# EAGLE design RoboRoach (EAGLE 6.4)
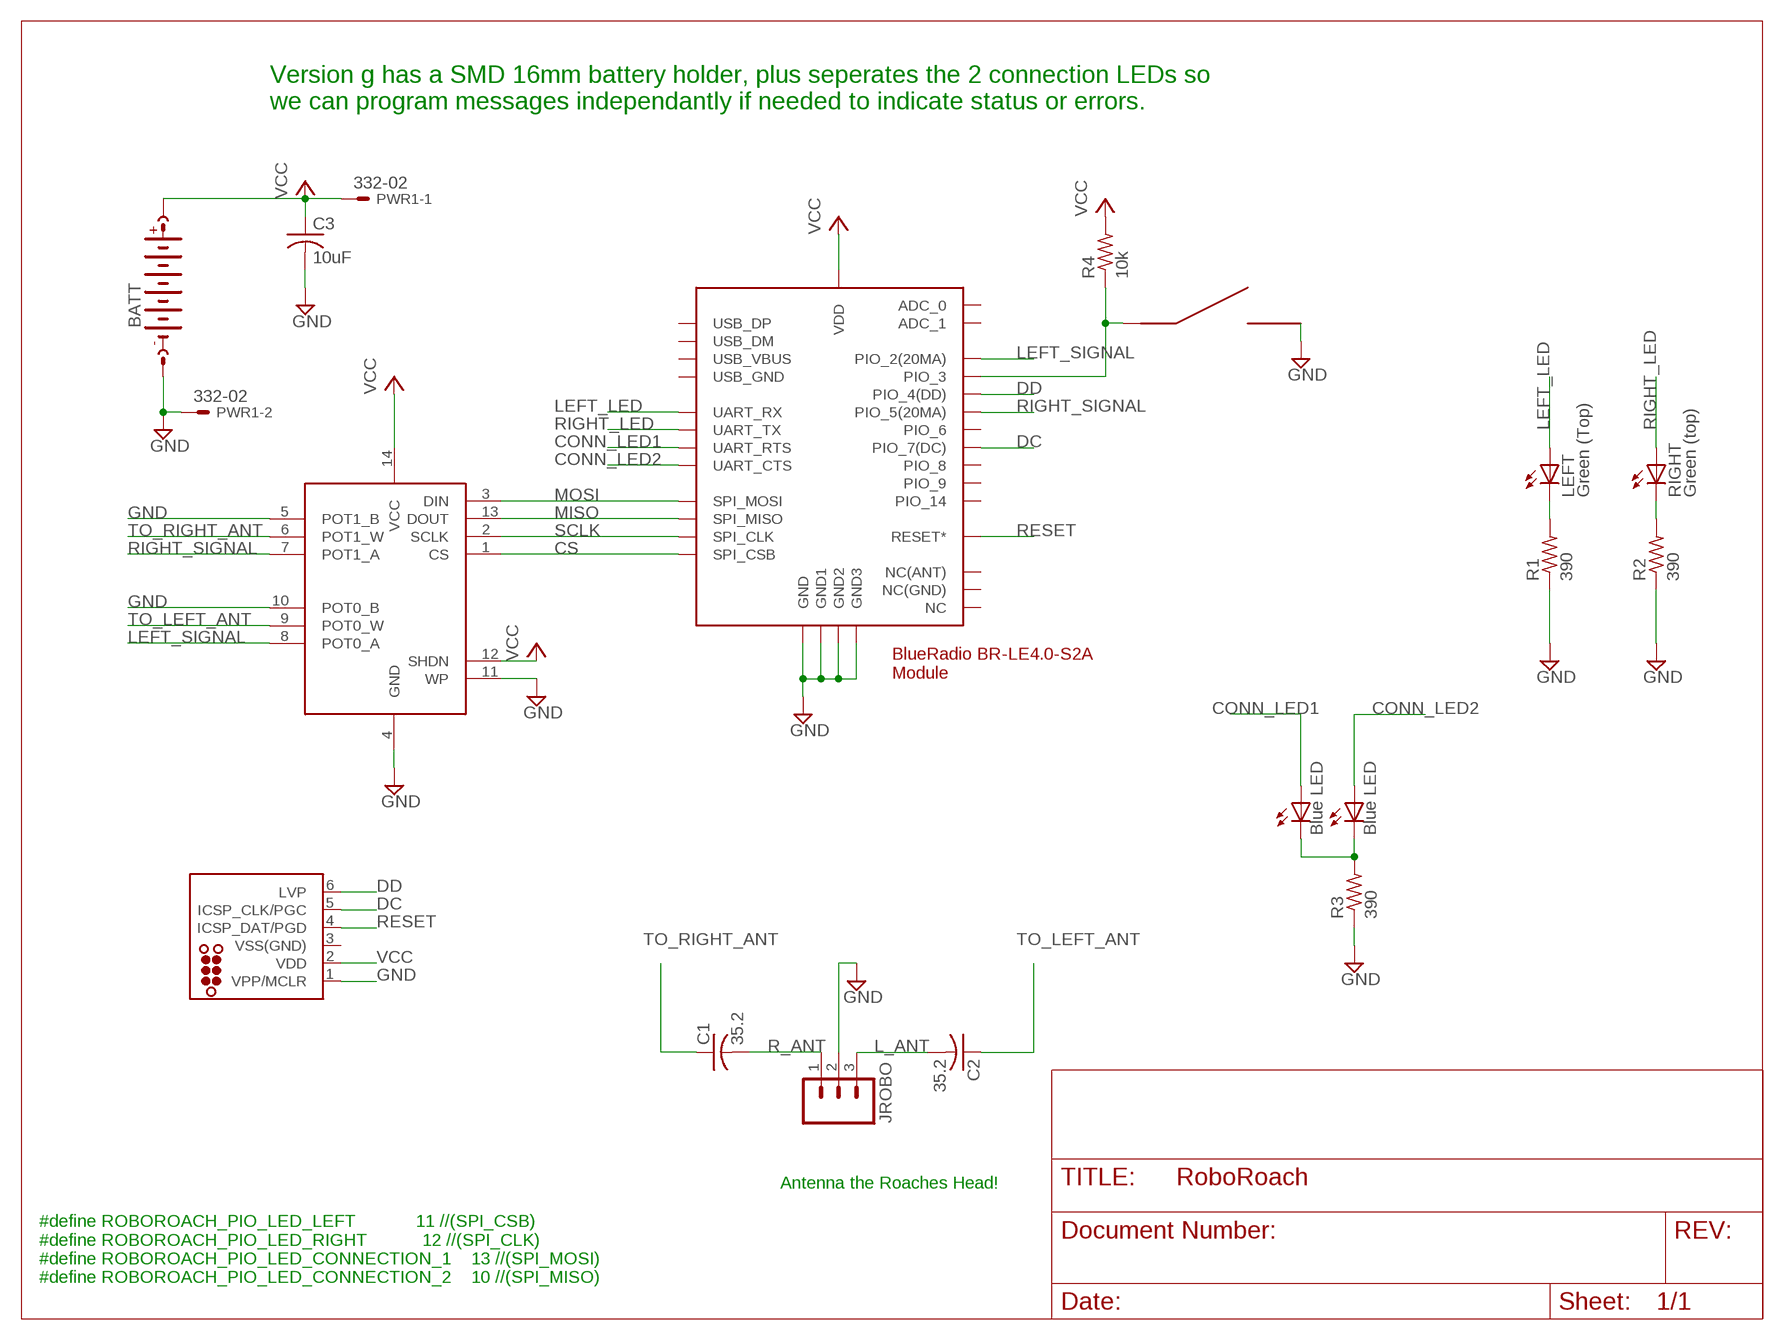
[diagram p0: schematic, sheet 1]

## Parts
BATT  BATTERY-16MMSMD  [16M_BATT_SMD]
C1  35.2  C-USC0805  [C0805]
C2  35.2  C-USC0805  [C0805]
C3  10uF  C-USC0805  [C0805]
CONNECTION  Blue LED  LEDCHIPLED_1206  [CHIPLED_1206]
CONNECTION1  Blue LED  LEDCHIPLED_1206  [CHIPLED_1206]
IC1  BR-LE4.0-S2  [BR-LE4.0-X2A]
J1  TC2030-MCP-NL  [TC2030-MCP-NL]
JROBO  M03PTH  [1X03]
LEFT  Green (Top)  LEDCHIPLED_1206  [CHIPLED_1206]
POT  MCP4251  [TSSOP14]
PWR1  332-02  [332-02]
R1  390  R-US_R0805  [R0805]
R2  390  R-US_R0805  [R0805]
R3  390  R-US_R0805  [R0805]
R4  10k  R-US_R0805  [R0805]
RIGHT  Green (top)  LEDCHIPLED_1206  [CHIPLED_1206]
U$2  B3U-1000X  [B3U]

## Nets
CONN_LED1: CONNECTION1.A IC1.P$12(UART_RTS)
CONN_LED2: CONNECTION.A IC1.P$11(UART_CTS)
CS: IC1.P$6(SPI_CSB) POT.1(CS)
DC: IC1.P$29(PIO_7(DC)) J1.5(ICSP_CLK/PGC)
DD: IC1.P$28(PIO_4(DD)) J1.6(LVP)
GND: BATT.NEG(-) C3.2 IC1.P$1(GND) IC1.P$10(GND1) IC1.P$20(GND2) IC1.P$30(GND3) J1.1(VPP/MCLR) JROBO.2 POT.4(GND) POT.5(POT1_B) POT.10(POT0_B) POT.11(WP) PWR1.2 R1.1 R2.1 R3.1 U$2.PAD2
L_ANT: C2.2 JROBO.3
LEFT_LED: IC1.P$14(UART_RX) LEFT.A
LEFT_SIGNAL: IC1.P$23(PIO_2(20MA)) POT.8(POT0_A)
MISO: IC1.P$5(SPI_MISO) POT.13(DOUT)
MOSI: IC1.P$8(SPI_MOSI) POT.3(DIN)
N$1: LEFT.C R1.2
N$2: CONNECTION1.C CONNECTION.C R3.2
N$4: IC1.P$26(PIO_3) R4.1 U$2.PAD1
N$9: R2.2 RIGHT.C
R_ANT: C1.2 JROBO.1
RESET: IC1.P$3(RESET*) J1.4(ICSP_DAT/PGD)
RIGHT_LED: IC1.P$13(UART_TX) RIGHT.A
RIGHT_SIGNAL: IC1.P$24(PIO_5(20MA)) POT.7(POT1_A)
SCLK: IC1.P$7(SPI_CLK) POT.2(SCLK)
TO_LEFT_ANT: C2.1 POT.9(POT0_W)
TO_RIGHT_ANT: C1.1 POT.6(POT1_W)
VCC: BATT.POS1(+) BATT.POS2(+) C3.1 IC1.P$9(VDD) J1.2(VDD) POT.12(SHDN) POT.14(VCC) PWR1.1 R4.2
Unconnected: IC1.P$2(NC) IC1.P$4(ADC_1) IC1.P$15(USB_VBUS) IC1.P$16(USB_GND) IC1.P$17(USB_DP) IC1.P$18(USB_DM) IC1.P$19(PIO_14) IC1.P$21(ADC_0) IC1.P$22(PIO_9) IC1.P$25(PIO_6) IC1.P$27(PIO_8) IC1.P$31(NC(ANT)) IC1.P$32(NC(GND))

## Notes on the sheet
- Version g has a SMD 16mm battery holder, plus seperates the 2 connection LEDs so 
  we can program messages independantly if needed to indicate status or errors.
- BlueRadio BR-LE4.0-S2A 
  Module
- Antenna the Roaches Head!
- #define ROBOROACH_PIO_LED_LEFT            11 //(SPI_CSB)
  #define ROBOROACH_PIO_LED_RIGHT           12 //(SPI_CLK)
  #define ROBOROACH_PIO_LED_CONNECTION_1    13 //(SPI_MOSI)
  #define ROBOROACH_PIO_LED_CONNECTION_2    10 //(SPI_MISO)

## Power pins joined to a net without a drawn wire
VSS(GND): J1.3(VSS(GND))

## Library data of the parts
BATT = byb:BATTERY-16MM
C1-C3 = byb_rcl:C-US: CAPACITOR, American symbol
CONNECTION CONNECTION1 LEFT RIGHT = led:LED: LED OSRAM: - CHIPLED LG R971, LG N971, LY N971, LG Q971, LY Q971, LO R971, LY R971 LH N974, LH R974 LS Q976, LO Q976, LY Q976 LO Q996 - Hyper CHIPLED LW Q18S LB Q993, LB Q99A, LB R99A - SideLED LS A670, LO A670, LY A670, LG A670, LP A670 LB A673, LV A673, LT A673, LW A673 LH A674 LY A675 LS A676, LA A676, LO A676, LY A676, LW A676 LS A679, LY A679, LG A679 - Hyper Micro SIDELED® LS Y876, LA Y876, LO Y876, LY Y876 LT Y87S - SmartLED LW L88C, LW L88S LB L89C, LB L89S, LG L890 LS L89K, LO L89K, LY L89K LS L896, LA L896, LO L896, LY L896 - TOPLED LS T670, LO T670, LY T670, LG T670, LP T670 LSG T670, LSP T670, LSY T670, LOP T670, LYG T670 LG T671, LOG T671, LSG T671 LB T673, LV T673, LT T673, LW T673 LH T674 LS T676, LA T676, LO T676, LY T676, LB T676, LH T676, LSB T676, LW T676 LB T67C, LV T67C, LT T67C, LS T67K, LO T67K, LY T67K, LW E67C LS E67B, LA E67B, LO E67B, LY E67B, LB E67C, LV E67C, LT E67C LW T67C LS T679, LY T679, LG T679 LS T770, LO T770, LY T770, LG T770, LP T770 LB T773, LV T773, LT T773, LW T773 LH T774 LS E675, LA E675, LY E675, LS T675 LS T776, LA T776, LO T776, LY T776, LB T776 LHGB T686 LT T68C, LB T68C - Hyper Mini TOPLED® LB M676 - Mini TOPLED Santana® LG M470 LS M47K, LO M47K, LY M47K Source: http://www.osram.convergy.de LUXEON: - LUMILED® LXK2-PW12-R00, LXK2-PW12-S00, LXK2-PW14-U00, LXK2-PW14-V00 LXK2-PM12-R00, LXK2-PM12-S00, LXK2-PM14-U00 LXK2-PE12-Q00, LXK2-PE12-R00, LXK2-PE12-S00, LXK2-PE14-T00, LXK2-PE14-U00 LXK2-PB12-K00, LXK2-PB12-L00, LXK2-PB12-M00, LXK2-PB14-N00, LXK2-PB14-P00, LXK2-PB14-Q00 LXK2-PR12-L00, LXK2-PR12-M00, LXK2-PR14-Q00, LXK2-PR14-R00 LXK2-PD12-Q00, LXK2-PD12-R00, LXK2-PD12-S00 LXK2-PH12-R00, LXK2-PH12-S00 LXK2-PL12-P00, LXK2-PL12-Q00, LXK2-PL12-R00 Source: www.luxeon.com KINGBRIGHT: KA-3528ASYC Source: www.kingbright.com
IC1 = byb:BR-LE4.0-S2
J1 = tag-connect:TC2030: TAG-CONNECT ICSP Connector Manufacturer: Tag-Connect <http://www.tag-connect.com> Cable for easy In-Circuit Serial Programming. Designed for Microchip ICD2, suitable for many others. Two variants - one "with legs" (for hands-free fit on PCB) and another "without legs" for quick programming. PAD Description 1 MCLR/Vpp 2 Vdd 3 GND 4 PGD (ISPDAT) 5 PGC (ISPCLK) 6 nc (used for LVP) ©2009 ROFA.cz - modified and updated by Robert Darlington ‹rdarlington@gmail.com›
JROBO = SparkFun:M03: Header 3 Standard 3-pin 0.1" header. Use with straight break away headers (SKU : PRT-00116), right angle break away headers (PRT-00553), swiss pins (PRT-00743), machine pins (PRT-00117), and female headers (PRT-00115). Molex polarized connector foot print use with SKU : PRT-08232 with associated crimp pins and housings.
POT = RoboRoach:MCP4251
PWR1 = con-garry:332-02: 2 Pin - 2mm Dual Row Source: www.mpe-connector.de / garry_shortform_2012.pdf
R1-R4 = byb_rcl:R-US_: RESISTOR, American symbol
U$2 = RoboRoach:B3U-1000X

## Net classes
0 default: width 0.152 mm, drill 0.152 mm, clearance 0.152 mm

## Board
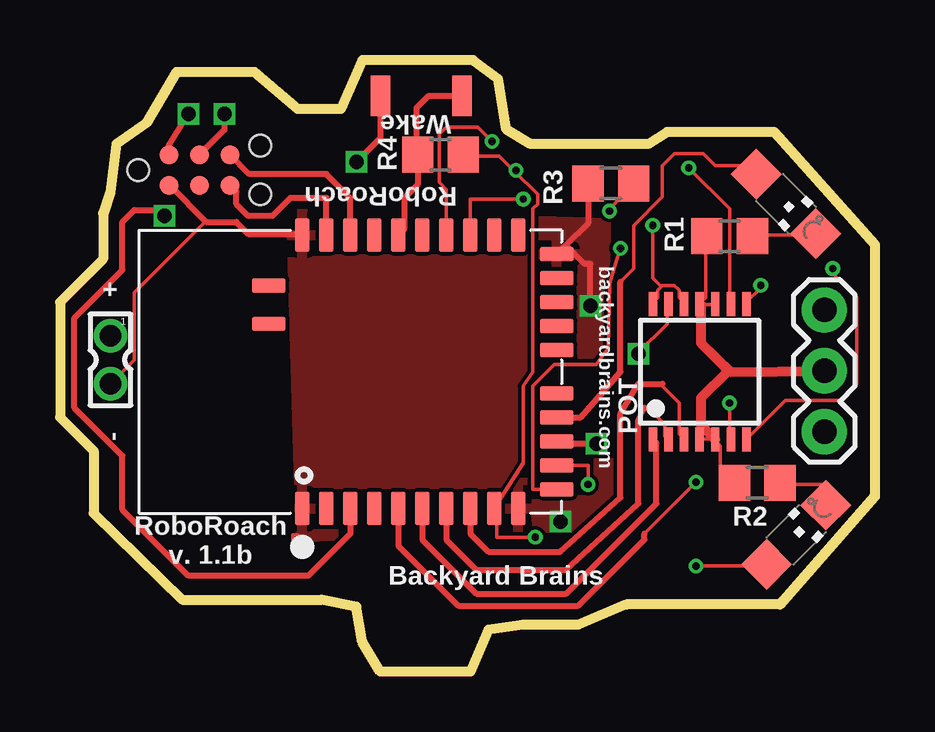
[diagram p1: board, top side]
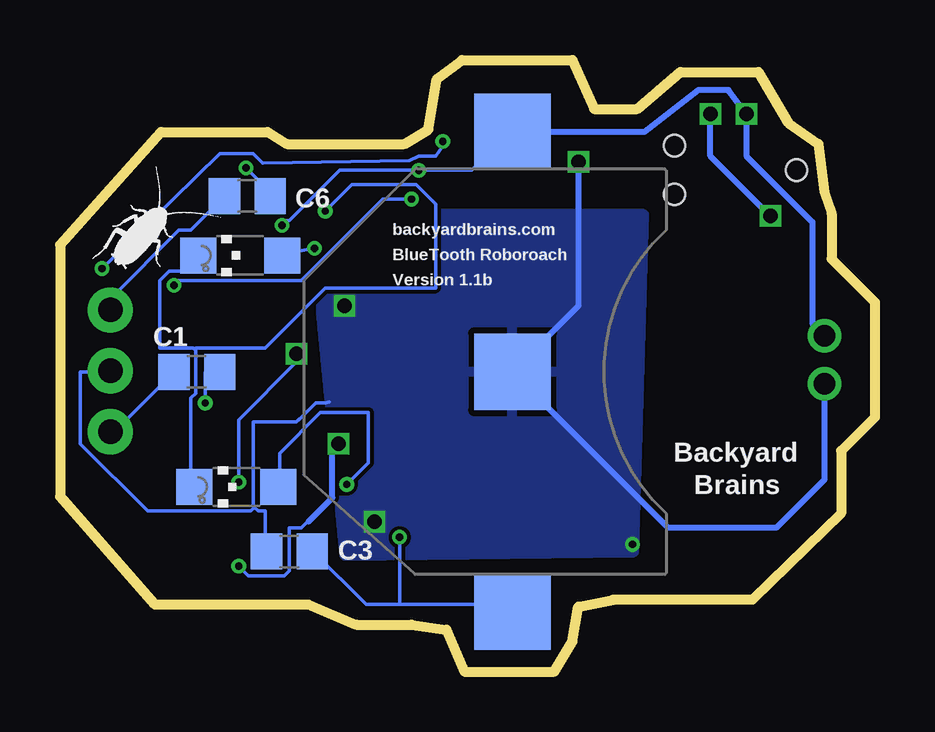
[diagram p2: board, bottom side, seen from below]

Size 33.95 x 25.5 mm. Coordinates in mm from the lower left corner, seen from the top.
Outline: 33.95,17.8 33.95,7.3 30,2.8 23.6,2.8 21.6,1.95 19.3,1.95 17.85,1.75 17.1,0 13.35,0 12.6,1.25 12.35,2.7 10.9,3 5.1,3 1.4,6.6 1.4,9.2 0,10.6 0,15.4 1.8,17.2 1.8,19.1 2.1,20 2.35,22 3.6,22.88 4.85,25 8.1,25 9.9,23.45 11.7,23.45 12.6,25.5 17.2,25.5 18.25,24.7 18.6,22.6 19.6,22 24.5,22 25.3,22.5 29.75,22.5 33.95,17.8
Copper layers (1*16): Top 0.035mm / dielectric 1.5mm / Bottom 0.035mm
Design rules "Fusion_eagle_rule_v1.1": minimum track width 6mil, minimum drill 12mil, track to track 6mil, track to pad 6mil, pad to pad 6mil, via to via 6mil, smd to smd 0mil, copper to edge 10mil, drill to drill 10mil, minimum pad ring 10mil, minimum via ring 6mil, stop-mask expansion 2mil, vias tented up to drill 100mil, thermal gap 10mil

### Footprints (pad centres in the part's own frame; a part is rotated, then mirrored left to right if it is on the bottom)
16M_BATT_SMD = smd 3.2 x 3.2: NEG 0,0; POS1 -10,0; POS2 10,0
C0805 = smd 1.3 x 1.5: 1 -0.95,0; 2 0.95,0
CHIPLED_1206 = smd 1.5 x 1.5: A 0,-1.75; C 0,1.75
BR-LE4.0-X2A = smd 0.6 x 1.4: P$1 -2,-5.7; P$2 -1,-5.7; P$3 0,-5.7; P$4 1,-5.7; P$5 2,-5.7; P$6 3,-5.7; P$7 4,-5.7; P$8 5,-5.7; P$9 6,-5.7; P$10 7,-5.7; P$21 7,5.7; P$22 6,5.7; P$23 5,5.7; P$24 4,5.7; P$25 3,5.7; P$26 2,5.7; P$27 1,5.7; P$28 0,5.7; P$29 -1,5.7; P$30 -2,5.7 | smd 1.4 x 0.6: P$11 8.6,-4.9; P$12 8.6,-3.9; P$13 8.6,-2.9; P$14 8.6,-1.9; P$15 8.6,-0.9; P$16 8.6,0.9; P$17 8.6,1.9; P$18 8.6,2.9; P$19 8.6,3.9; P$20 8.6,4.9; P$31 -3.4,3.6; P$32 -3.4,2
TC2030-MCP-NL = smd 0.787 x 0.787: 1 1.27,-0.635; 2 1.27,0.635; 3 2.54,-0.635; 4 2.54,0.635; 5 3.81,-0.635; 6 3.81,0.635 | hole 0.889: 0,0; 5.08,-1.016; 5.08,1.016
1X03 = drill 1.016 pad 1.88: 1 0,0; 2 2.54,0; 3 5.08,0
TSSOP14 = smd 0.35 x 1: 1 -1.95,-2.825; 2 -1.3,-2.825; 3 -0.65,-2.825; 4 0,-2.825; 5 0.65,-2.825; 6 1.3,-2.825; 7 1.95,-2.825; 8 1.95,2.825; 9 1.3,2.825; 10 0.65,2.825; 11 0,2.825; 12 -0.65,2.825; 13 -1.3,2.825; 14 -1.95,2.825
332-02 = drill 0.9 pad 1.27: 1 0,-1; 2 0,1
R0805 = smd 1.3 x 1.5: 1 -0.95,0; 2 0.95,0
B3U = smd 0.8 x 1.7: PAD1 1.7,0; PAD2 -1.7,0

### Placement (x,y rotation side)
BATT  15.1,12.5 270 bottom
C1  28.25,12.5 180 bottom
C2  26.15,19.83 180 bottom
C3  24.39,5.01 180 bottom
CONNECTION  26.45,17.35 90 bottom
CONNECTION1  26.6,7.7 90 bottom
IC1  12.1,12.5 0 top
J1  3.26,20.91 0 top
JROBO  31.85,10 90 top
LEFT  30.25,19.5 225 top
LOGOBOTTOM  [BYBLOGO-S]  30.6,18.2 315 bottom
POT  26.65,12.5 0 top
PWR1  2.1,13 180 top
R1  27.9,18.15 0 top
R2  29.05,7.87 0 top
R3  22.95,20.35 0 top
R4  15.85,21.55 0 top
RIGHT  30.68,5.7 315 top
U$2  15.05,24 0 top

### Tracks (layer width: path | path; a pad name or v marks a point on that pad's centre or on a via)
CONN_LED1  (via drill 0.3)
  Top 0.152: IC1.P$12 22,8.6 v22,7.8
  Bottom 0.152: v22,7.8 21.1,8.7 21.1,10.8 23.1,10.8 24.8,9.1 24.8,7.7 CONNECTION1.A
CONN_LED2  (via drill 0.3)
  Top 0.152: IC1.P$11 19.7,7.6 19.7,11.9 20.6,12.8 22.35,12.8 22.85,13.5 22.9,16.2 v23.35,17.65
  Bottom 0.152: v23.35,17.65 24.6,17.4 24.7,17.4 CONNECTION.A
CS
  Top 0.254: IC1.P$6 15.1,5.5 17.35,3.25 21.1,3.25 24.85,7 24.85,9.52 POT.1
DC
  Top 0.254: IC1.P$29 11.1,19.75 9.6,19.75 8.85,19 7.85,19 7.35,19.5 7.35,20 J1.5
DD
  Top 0.254: IC1.P$28 12.1,19.75 11.1,20.75 7.87,20.75 J1.6
GND  (via drill 0.3, 0.6)
  Top 0.152: PWR1.2 3.1,13 3.1,15.8 6,18.7 6.1,18.75 | 10.03,5.64 9.9,5.7 9.7,5.7 9.7,5.5 9.9,5.3 v10.1,5.3 10.1,5.6 | POT.10 27.3,15.3 26.7,15.3 POT.11 26.7,15.4 26.9,15.6 26.9,18.1 R1.1 | R2.1 28.1,7.9 27.5,8.5 27.5,9.4 27.3,9.6 POT.5 27.3,9.7 26.7,9.7 POT.4 | IC1.P$1 | IC1.P$10
  Top 0.254: J1.1 4.58,20.27 6.1,18.75 7.35,18.75 7.85,18.25 10.05,18.25 IC1.P$30 | U$2.PAD2 13.35,22.25 v12.35,21.25 | R3.1 22,18.7 21.08,17.77 | 21.08,17.77 IC1.P$20 | v22.1,15.25 22.1,17 21.85,17 21.08,17.77
  Top 0.406: 26.7,15.3 26.7,13.7 | 26.7,13.7 27.9,12.5 27.8,12.5 26.7,11.4 26.7,10.27 POT.5 | 26.7,13.7 27.95,12.5 JROBO.2
  Bottom 0.152: 25.85,6.85 25.9,6.9 25.9,10.4 24.1,10.4 24.01,10.5 | 25.85,6.85 25.7,6.7 25.4,6.7 25.4,5.1 C3.2 | 24.01,10.5 23.99,10.52 | 25.85,6.85 26,6.7 30.3,6.7 33.1,9.5 33.1,12.5 31.9,12.5 JROBO.2 | 24.01,10.5 24,10.5 23.3,11.2 22.9,11.2 22.73,11.23
  Bottom 0.254: PWR1.2 2.1,8 4.1,6 8.6,6 BATT.NEG 12.35,15.25 v12.35,21.25
  other vias: 20.85,6.25
  pour Bottom: 9.61,19.07 23.49,19.06 22.1,4.83 10.03,4.98
  pour Top: 22.73,18.72 23,6.02 16.15,5.93 10.03,5.58 9.63,19.12
L_ANT
  Bottom 0.152: C2.2 27.1,19.8 28.5,18.4 29,18.4 31.8,15.6 31.8,15.1 JROBO.3
LEFT_LED
  Top 0.152: 23.35,16.25 23.9,16.8 23.9,18.6 25.1,19.8 25.1,21.1 25.6,21.6 26.8,21.6 27.3,21.1 28.65,21.1 LEFT.A 29,20.8
  Top 0.254: IC1.P$14 21.7,10.6 23.35,12.5 23.35,16.25
LEFT_SIGNAL  (via drill 0.3)
  Top 0.152: v19.3,19.7 17.1,19.7 IC1.P$23 | v29.2,16.1 29.2,16 28.6,15.4 POT.8
  Bottom 0.152: v19.3,19.7 20.5,19.7 23.9,16.3 29,16.3 v29.2,16.1
MISO  (via drill 0.3, 0.6)
  Top 0.152: v24.1,13.25 24.1,13.3 25.3,14.5 25.3,15.3 POT.13 | 24.35,5.75 v26.5,7.9
  Top 0.254: IC1.P$5 14.1,5.25 16.6,2.75 21.6,2.75 24.35,5.5 24.35,5.75
  Bottom 0.152: v24.1,13.25 24.1,12.9 26.5,10.5 v26.5,7.9
MOSI
  Top 0.152: POT.3 26,9.7 25.8,9.9 25.8,11.2 25.1,11.9 25.1,12
  Top 0.254: IC1.P$8 17.1,5.75 17.85,5 20.85,5 23.35,7.25 23.35,10.75 24.1,12 25.1,12
N$1
  Top 0.152: R1.2 28.9,18.2 31.4,18.2 LEFT.C
N$2  (via drill 0.3)
  Top 0.152: 23.9,20.4 R3.2 23.9,20.3 22.9,19.3 v22.9,19.2
  Bottom 0.152: 28.35,13.45 28.3,13.4 28.3,11.6 28.5,11.4 28.5,7.7 CONNECTION1.C | 28.35,13.45 28.4,13.5 29.8,13.5 29.8,16.3 29.4,16.7 28.8,16.7 28.2,17.3 CONNECTION.C | v22.9,19.2 21.8,20.3 19.1,20.3 18.3,19.5 18.3,16 22.9,16 25.4,13.5 28.3,13.5 28.35,13.45
N$4
  Top 0.254: IC1.P$26 14.35,18.45 14.35,19.75 14.9,20.3 R4.1 14.85,21.6 14.85,23.5 15.35,24 U$2.PAD1
N$9
  Top 0.152: R2.2 30,7.8 31.9,7.8 31.9,7 RIGHT.C
R_ANT
  Bottom 0.152: C1.2 31.7,10 JROBO.1
RESET  (via drill 0.6)
  Top 0.254: IC1.P$3 12.1,5.75 10.35,4 5.35,4 2.6,6.75 2.6,9 0.6,11 0.6,14.75 2.6,16.75 2.6,18.75 3.1,19.25 4.1,19.25 v4.35,19 | v6.85,23.25 6.85,22.59 J1.4
  Bottom 0.254: v4.35,19 6.85,21.5 v6.85,23.25
RIGHT_LED  (via drill 0.3, 0.6)
  Top 0.152: v26.5,4.4 29.4,4.4 RIGHT.A
  Top 0.254: v22.35,9.5 20.8,9.5 IC1.P$13
  Bottom 0.152: v26.5,4.4 26.1,4 24.6,4 24.4,4.2 24.4,6 23.9,6 23.7,6.2 23.6,6.25
  Bottom 0.254: 23.6,6.25 22.6,7.25 22.6,9.25 v22.35,9.5
RIGHT_SIGNAL  (via drill 0.3)
  Top 0.152: IC1.P$24 16.1,20.1 15.8,20.4 15.8,22.4 16.1,22.7 17.4,22.7 v18,22.1 | v32.2,16.8 32.2,16.6 33.2,15.6 33.2,12 32.5,11.3 30.23,11.3 POT.7
  Bottom 0.152: v18,22.1 18,21.9 18.3,21.5 19,21.5 19.4,21.3 25.5,21.2 25.9,21.6 27.3,21.6 v32.2,16.8
SCLK
  Top 0.152: POT.2 25.3,9.7 25.2,9.8 25.2,10.3 24.6,10.9 24.6,11
  Top 0.254: IC1.P$7 16.1,5.5 17.35,4.25 21.1,4.25 24.1,7 24.1,10.5 24.35,11 24.6,11
TO_LEFT_ANT  (via drill 0.3)
  Top 0.152: v26.2,21 27.9,19.3 27.9,15.4 POT.9
  Bottom 0.152: 25.2,19.8 C2.1 25.1,19.9 v26.2,21
TO_RIGHT_ANT  (via drill 0.3)
  Top 0.152: v27.9,11.2 27.9,9.7 POT.6
  Bottom 0.152: v27.9,11.2 27.9,12.5 C1.1
VCC  (via drill 0.3, 0.6)
  Top 0.152: 24.7,15.3 POT.14 24.7,15.4 24.9,15.6 24.9,15.9 25.05,16.05 | 25.05,16.05 25.1,16.1 25.6,16.1 25.8,15.9 25.8,15.6 26,15.4 POT.12 | 18.95,20.85 18.3,21.5 16.8,21.5 R4.2 | 18.95,20.85 19.9,19.9 19.9,19.5 19.7,19.3 19.7,12.5 19.3,11.9 19.3,8.7 IC1.P$9 18.2,6.8 18.2,5.6 v19.8,5.6 | v19,20.9 18.95,20.85 | 25.05,16.05 24.7,16.4 v24.7,18.6
  Top 0.254: J1.2 4.53,21.93 v5.35,23.25
  Bottom 0.152: BATT.POS1 15.2,22.5 16.8,20.9 v19,20.9 22.3,20.9 24.4,18.8 24.5,18.8 v24.7,18.6 | 19.8,2.8 15.4,2.8 BATT.POS2 | 19.8,2.8 21.2,2.8 23.4,5 C3.1 | v19.8,5.6 19.8,2.8
  Bottom 0.254: PWR1.1 2.6,14.5 2.6,18.75 5.35,21.5 v5.35,23.25 6.1,24.25 7.35,24.25 9.6,22.5 BATT.POS1

### Text on the board
tNames: Wake | RoboRoach | backyardbrains.com | + | - | RoboRoach / v. 1.1b | Backyard Brains
bNames: C6 | backyardbrains.com | BlueTooth Roboroach | Version 1.1b | Backyard | Brains